# EAGLE design BYOB-BoosterPack-Template (EAGLE 7.3.0)
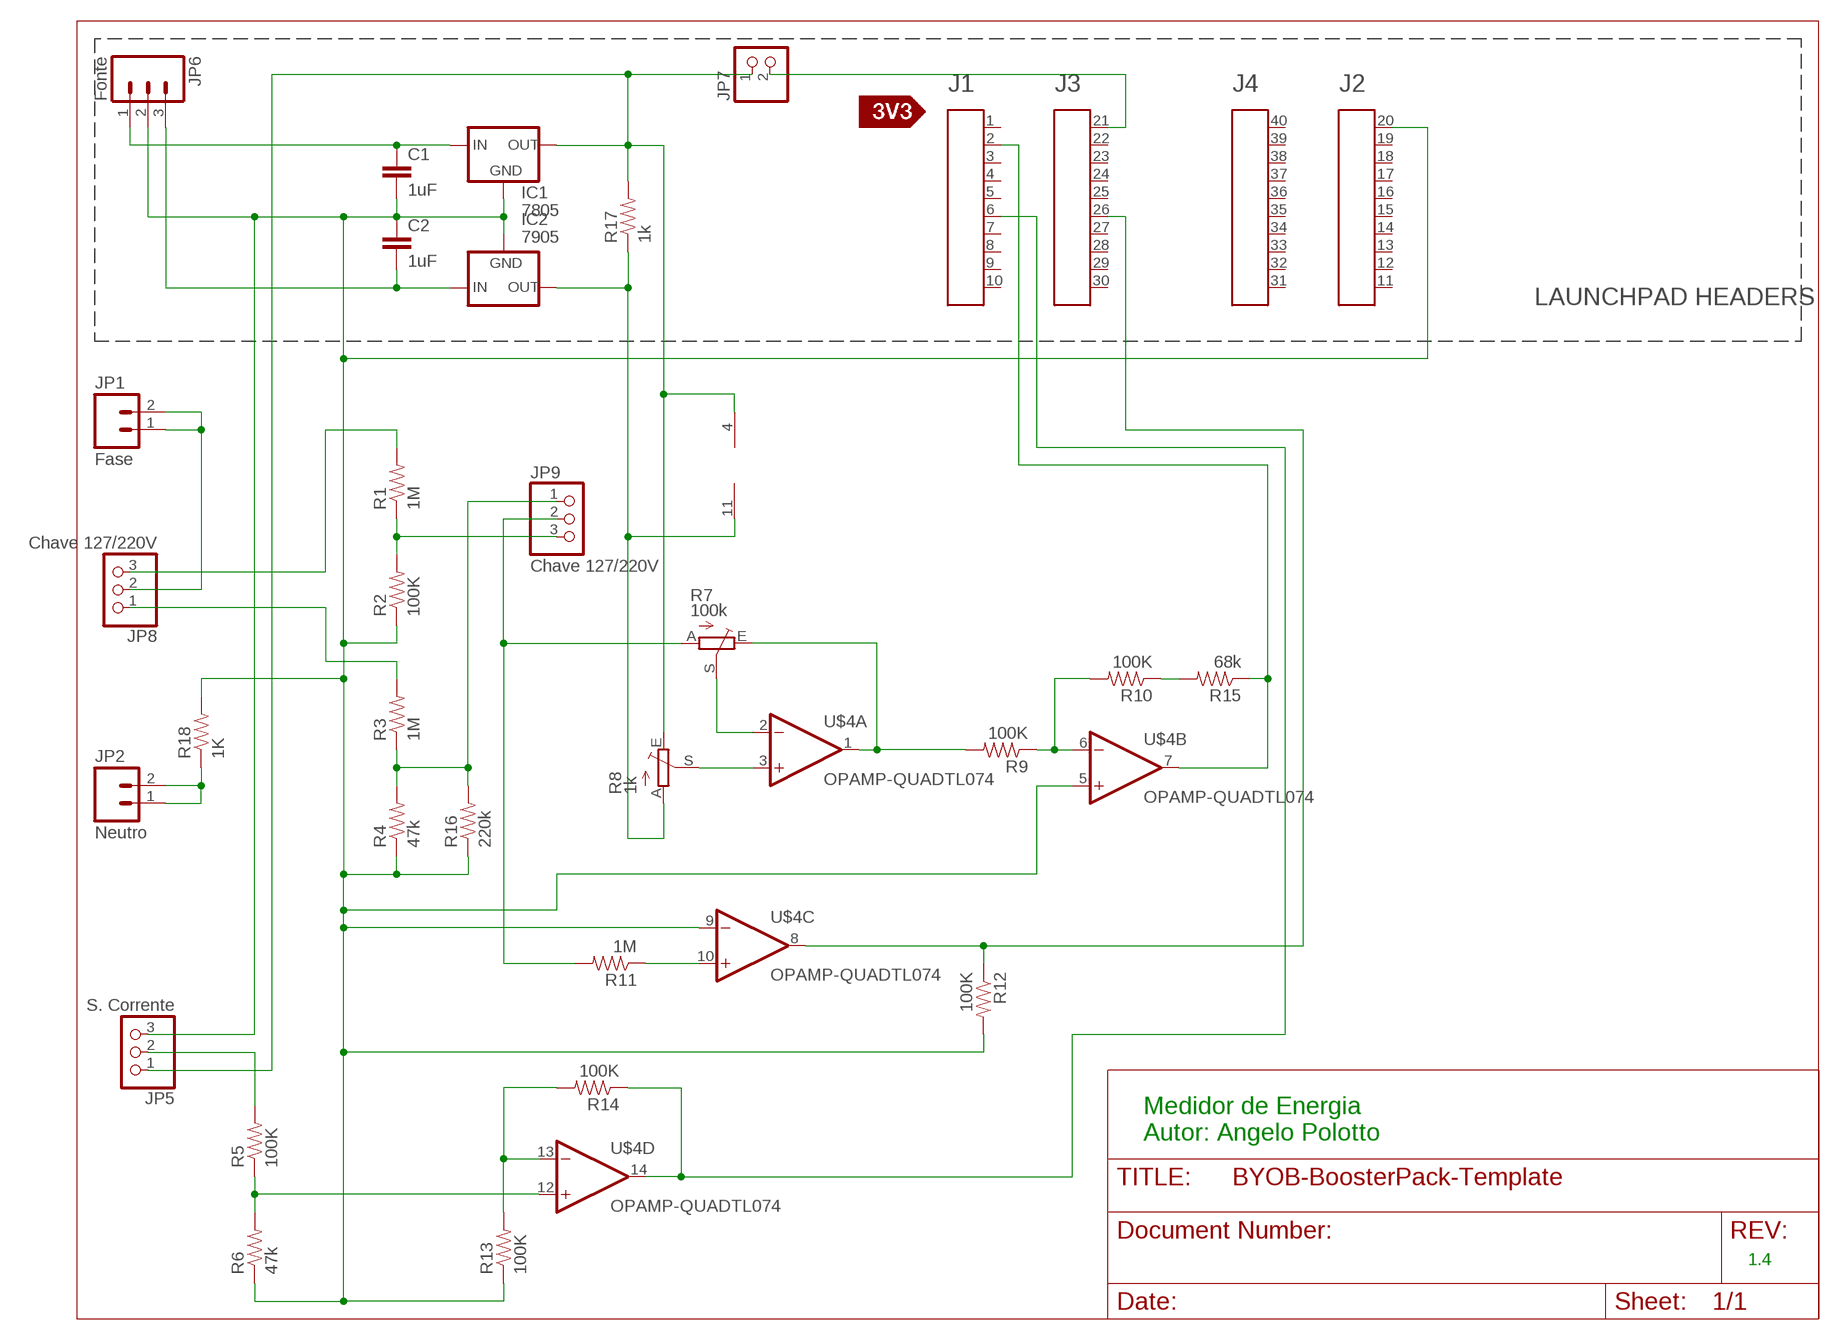
[diagram p0: schematic, sheet 1]

## Parts
A1  HEADER4X10-BOOSTERPACK  [4X10-BOOSTERPACK]
C1  1uF  0.1UF-50V-20%(PTH)KIT-EZ  [CAP-PTH-SMALL-KIT]
C2  1uF  0.1UF-50V-20%(PTH)KIT-EZ  [CAP-PTH-SMALL-KIT]
IC1  7805  78XXS  [78XXS]
IC2  7905  79XXS  [79XXS]
JP1  Fase  M02PTH4  [1X02_XTRA_BIG]
JP2  Neutro  M02PTH4  [1X02_XTRA_BIG]
JP5  S. Corrente  PINHD-1X3  [1X03]
JP6  Fonte  M03-SCREW-5MM  [SCREWTERMINAL-5MM-3]
JP7  PINHD-1X2  [1X02]
JP8  Chave 127/220V  PINHD-1X3  [1X03]
JP9  Chave 127/220V  PINHD-1X3  [1X03]
R1  1M  100KOHM-1/4W-1%(PTH)HORIZ  [AXIAL-0.3]
R2  100K  100KOHM-1/4W-1%(PTH)HORIZ  [AXIAL-0.3]
R3  1M  100KOHM-1/4W-1%(PTH)HORIZ  [AXIAL-0.3]
R4  47k  100KOHM-1/4W-1%(PTH)HORIZ  [AXIAL-0.3]
R5  100K  100KOHM-1/4W-1%(PTH)HORIZ  [AXIAL-0.3]
R6  47k  100KOHM-1/4W-1%(PTH)HORIZ  [AXIAL-0.3]
R7  100k  TRIM_EU-B64Y  [B64Y]
R8  1k  TRIM_EU-B64Y  [B64Y]
R9  100K  100KOHM-1/4W-1%(PTH)HORIZ  [AXIAL-0.3]
R10  100K  100KOHM-1/4W-1%(PTH)HORIZ  [AXIAL-0.3]
R11  1M  100KOHM-1/4W-1%(PTH)HORIZ  [AXIAL-0.3]
R12  100K  100KOHM-1/4W-1%(PTH)HORIZ  [AXIAL-0.3]
R13  100K  100KOHM-1/4W-1%(PTH)HORIZ  [AXIAL-0.3]
R14  100K  100KOHM-1/4W-1%(PTH)HORIZ  [AXIAL-0.3]
R15  68k  100KOHM-1/4W-1%(PTH)HORIZ  [AXIAL-0.3]
R16  220k  100KOHM-1/4W-1%(PTH)HORIZ  [AXIAL-0.3]
R17  1k  100KOHM-1/4W-1%(PTH)HORIZ  [AXIAL-0.3]
R18  1K  100KOHM-1/4W-1%(PTH)HORIZ  [AXIAL-0.3]
U$3  SILK_3V3_TAG  [SILK_3V3_TAG]
U$4  OPAMP-QUADTL074  [DIP14]

## Nets
GND: A1.20 C1.2 C2.1 IC1.GND IC2.GND JP5.3 JP6.2 R2.P$1 R4.P$1 R6.P$1 R12.P$2 R13.P$1 R16.P$1 R18.P$2 U$4.5(B:IN+) U$4.9(C:IN-)
N$1: JP9.3 R1.P$1 R2.P$2
N$2: JP9.1 R3.P$1 R4.P$2 R16.P$2
N$3: R5.P$1 R6.P$2 U$4.12(D:IN+)
N$4: JP8.3 R1.P$2
N$5: JP8.1 R3.P$2
N$6: A1.21 JP7.2
N$7: JP1.1 JP1.2 JP8.2
N$8: JP9.2 R7.A R11.P$2
N$9: JP2.1 JP2.2 R18.P$1
N$10: R7.S U$4.2(A:IN-)
N$11: IC1.OUT JP5.1 JP7.1 R8.E R17.P$2 U$4.4(SUP:VCC)
N$12: R7.E R9.P$2 U$4.1(A:OUT)
N$13: R8.S U$4.3(A:IN+)
N$14: C1.1 IC1.IN JP6.1
N$15: IC2.OUT R8.A R17.P$1 U$4.11(SUP:VEE)
N$16: R9.P$1 R10.P$2 U$4.6(B:IN-)
N$17: R10.P$1 R15.P$2
N$18: R11.P$1 U$4.10(C:IN+)
N$19: A1.26 R12.P$1 U$4.8(C:OUT)
N$20: JP5.2 R5.P$2
N$21: C2.2 IC2.IN JP6.3
N$22: R13.P$2 R14.P$2 U$4.13(D:IN-)
N$23: A1.6 R14.P$1 U$4.14(D:OUT)
N$27: A1.2 R15.P$1 U$4.7(B:OUT)
Unconnected: A1.1 A1.3 A1.4 A1.5 A1.7 A1.8 A1.9 A1.10 A1.11 A1.12 A1.13 A1.14 A1.15 A1.16 A1.17 A1.18 A1.19 A1.22 A1.23 A1.24 A1.25 A1.27 A1.28 A1.29 A1.30 A1.31 A1.32 A1.33 A1.34 A1.35 A1.36 A1.37 A1.38 A1.39 A1.40

## Notes on the sheet
- LAUNCHPAD HEADERS
- Medidor de Energia
  Autor: Angelo Polotto
- 1.4

## Library data of the parts
A1 = Public_BP_Library:HEADER4X10-BOOSTERPACK
C1 C2 = SparkFun-Capacitors:0.1UF-50V-20%(PTH): CAP-08370; PROD_ID: CAP-08370
IC1 = v-reg:78XXS: VOLTAGE REGULATOR
IC2 = v-reg:79XXS: VOLTAGE REGULATOR
JP1 JP2 = SparkFun-Connectors:M02: Standard 2-pin 0.1" header. Use with - straight break away headers ( PRT-00116) - right angle break away headers (PRT-00553) - swiss pins (PRT-00743) - machine pins (PRT-00117) - female headers (PRT-00115) Molex polarized connector foot print use with: PRT-08233 with associated crimp pins and housings. 2.54_SCREWTERM for use with PRT-10571. 3.5mm Screw Terminal footprints for PRT-08084 5mm Screw Terminal footprints for use with PRT-08432
JP5 JP8 JP9 = pinhead:PINHD-1X3: PIN HEADER
JP6 = SparkFun-Connectors:M03: Header 3 Standard 3-pin 0.1" header. Use with straight break away headers (SKU : PRT-00116), right angle break away headers (PRT-00553), swiss pins (PRT-00743), machine pins (PRT-00117), and female headers (PRT-00115). Molex polarized connector foot print use with SKU : PRT-08232 with associated crimp pins and housings.; STOREFRONT_ID: PRT-08433
JP7 = pinhead:PINHD-1X2: PIN HEADER
R1 R3 R4 R6 R11 R15-R18 = SparkFun-Resistors:100KOHM-1/4W-1%(PTH): RES-12184; PROD_ID: RES-12184; VALUE: 100K
R2 R5 R9 R10 R12-R14 = SparkFun-Resistors:100KOHM-1/4W-1%(PTH): RES-12184; PROD_ID: RES-12184
R7 R8 = pot:TRIM_EU-: POTENTIOMETER
U$3 = Public_BP_Library:SILK_3V3_TAG
U$4 = Op Amps:OPAMP-QUAD: Operational amplifier, quad; SPICE: X{NAME}A {A.IN+.NET} {A.IN-.NET} {VCC.NET} {VEE.NET} {A.OUT.NET} TL074\nX{NAME}B {B.IN+.NET} {B.IN-.NET} {VCC.NET} {VEE.NET} {B.OUT.NET} TL074\nX{NAME}C {C.IN+.NET} {C.IN-.NET} {VCC.NET} {VEE.NET} {C.OUT.NET} TL074\nX{NAME}D {D.IN+.NET} {D.IN-.NET} {VCC.NET} {VEE.NET} {D.OUT.NET} TL074; SPICEMOD: .SUBCKT TL074 1 2 3 4 5\nC1 11 12 3.498E-12\nC2 6 7 15.00E-12\nDC 5 53 DX\nDE 54 5 DX\nDLP 90 91 DX\nDLN 92 90 DX\nDP 4 3 DX\nEGND 99 0 POLY(2) (3,0) (4,0) 0 .5 .5\nFB 7 99 POLY(5) VB VC VE VLP VLN 0 4.715E6 -5E6 5E6 5E6 -5E6\nGA 6 0 11 12 282.8E-6\nGCM 0 6 10 99 8.942E-9\nISS 3 10 DC 195.0E-6\nHLIM 90 0 VLIM 1K\nJ1 11 2 10 JX\nJ2 12 1 10 JX\nR2 6 9 100.0E3\nRD1 4 11 3.536E3\nRD2 4 12 3.536E3\nRO1 8 5 150\nRO2 7 99 150\nRP 3 4 2.143E3\nRSS 10 99 1.026E6\nVB 9 0 DC 0\nVC 3 53 DC 2.200\nVE 54 4 DC 2.200\nVLIM 7 8 DC 0\nVLP 91 0 DC 25\nVLN 0 92 DC 25\n.MODEL DX D(IS=800.0E-18)\n.MODEL JX PJF(IS=15.00E-12 BETA=270.1E-6 VTO=-1)\n.ENDS

## Board
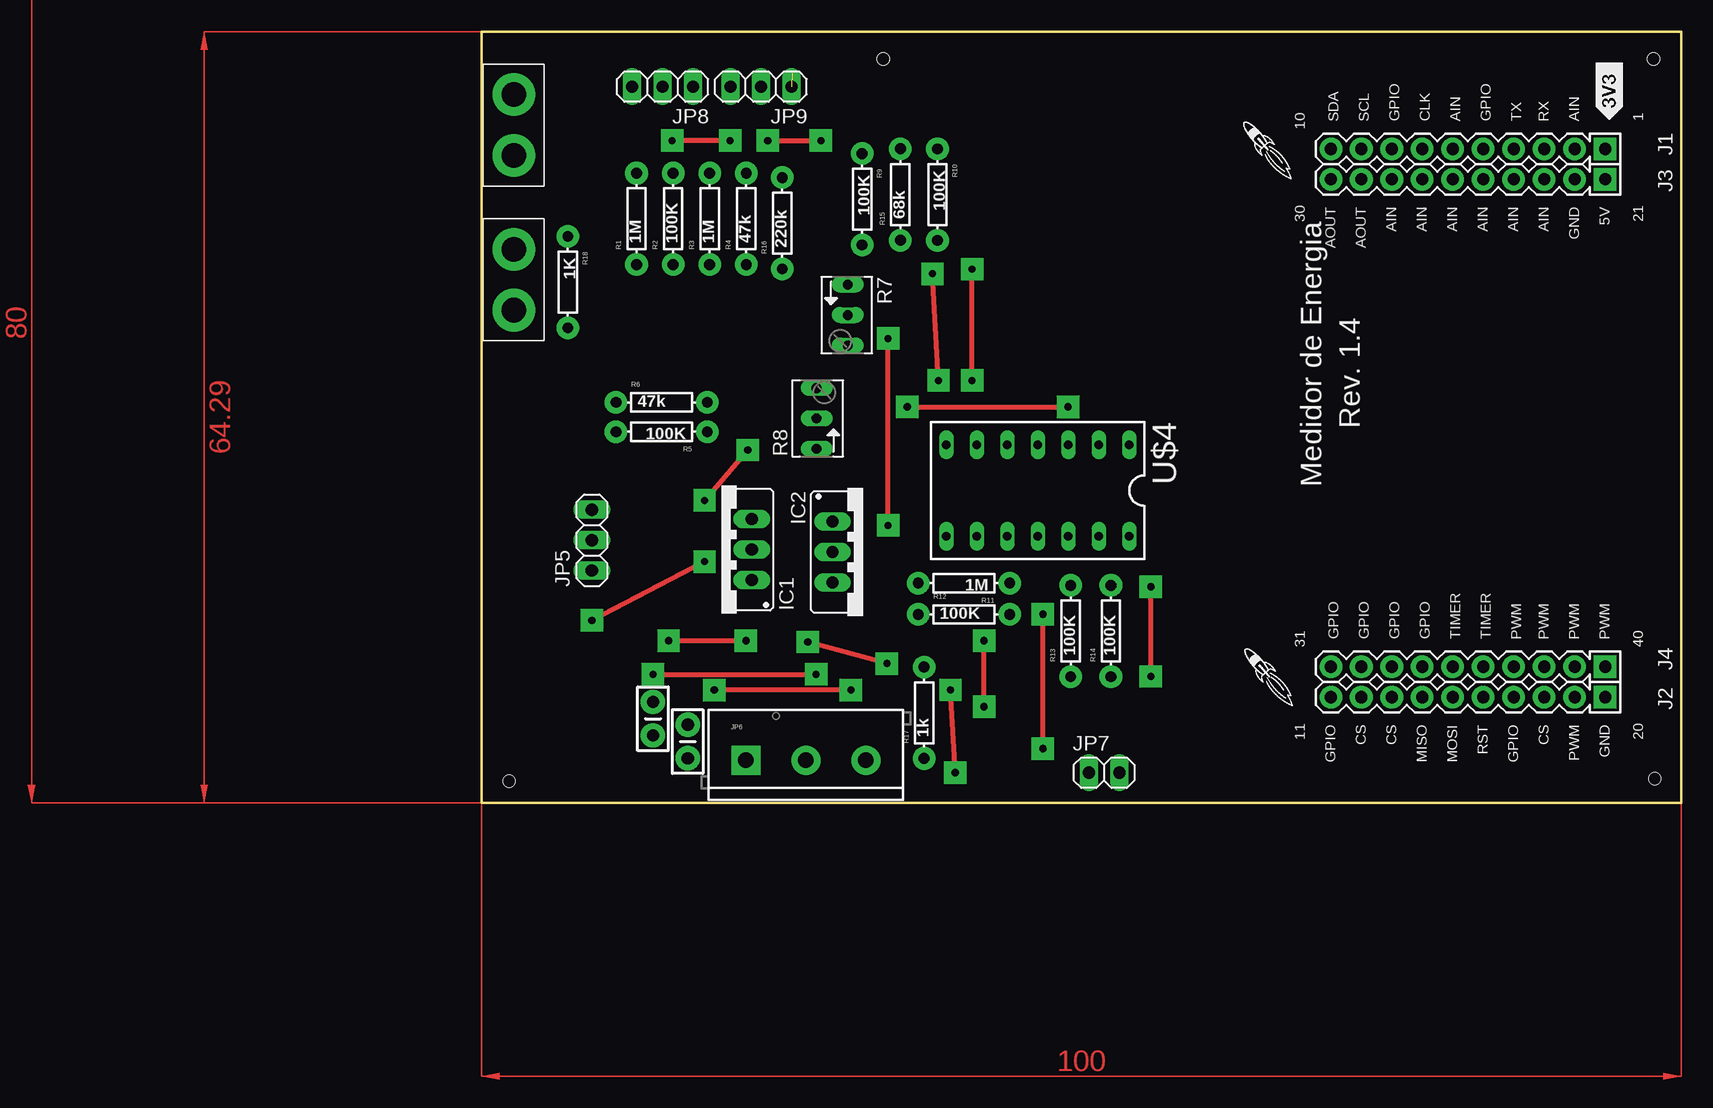
[diagram p1: board, top side]
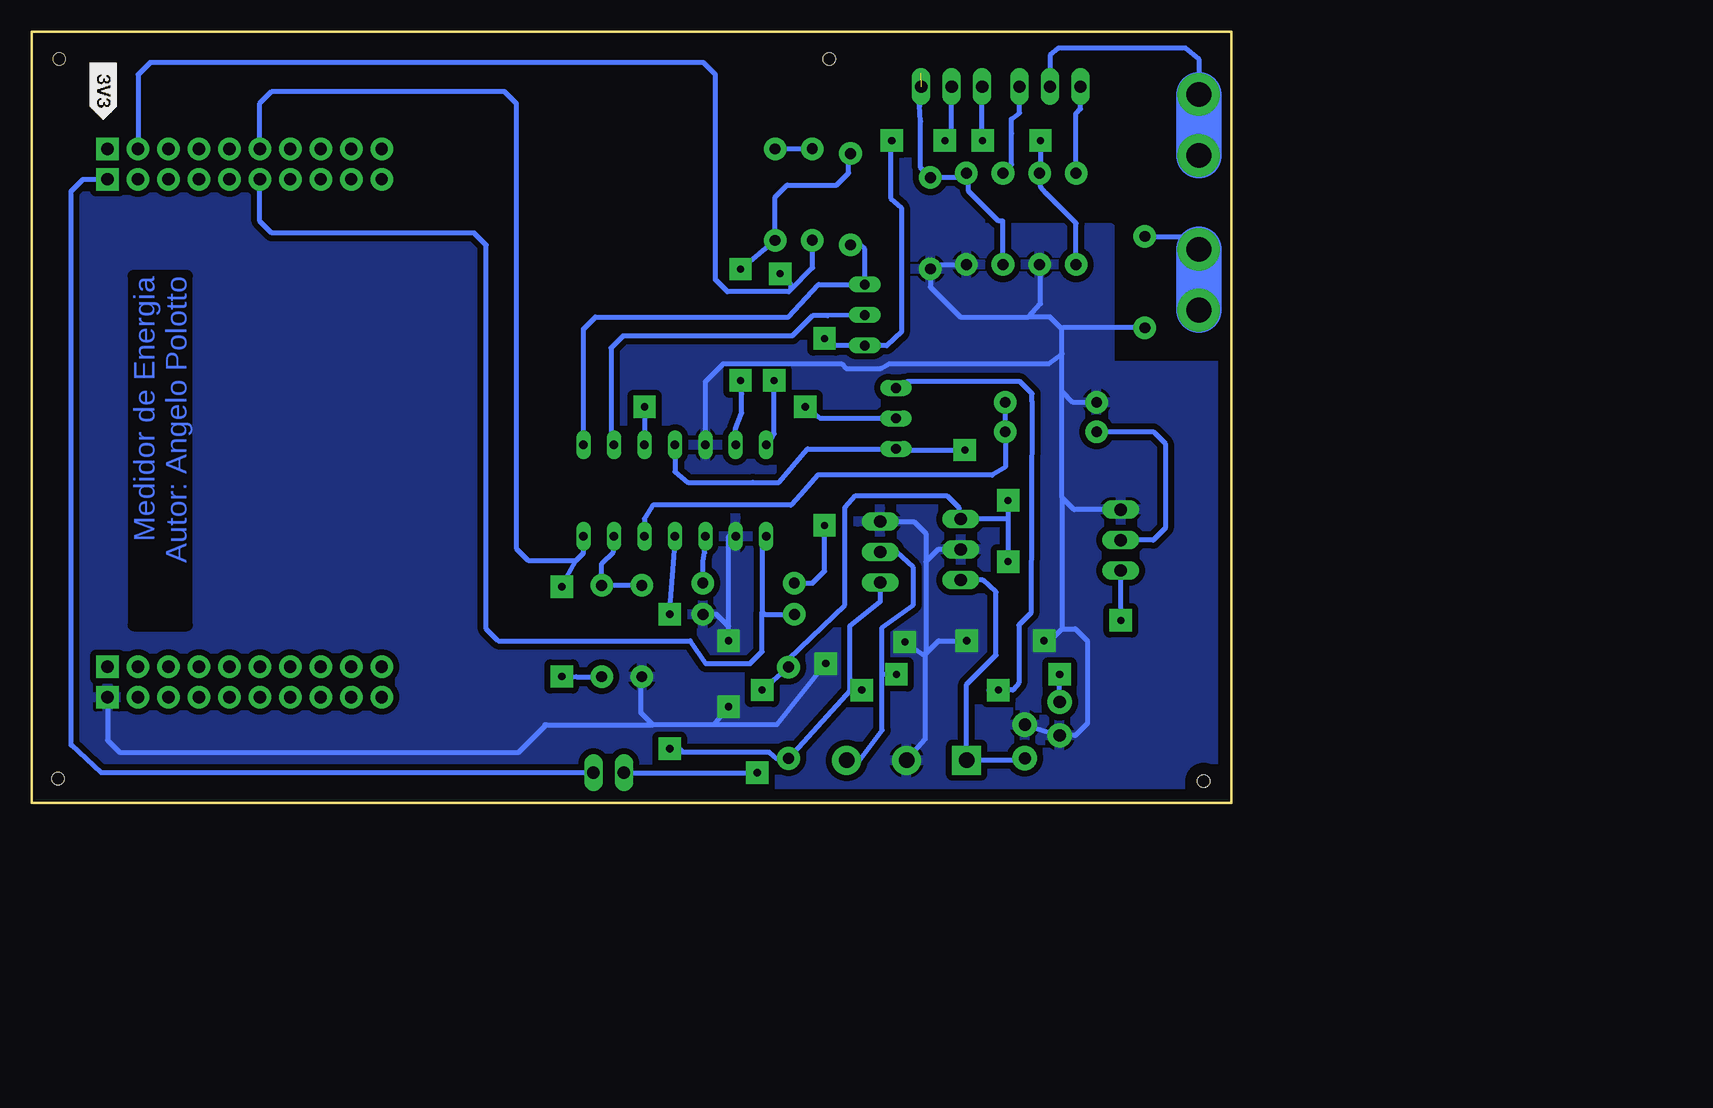
[diagram p2: board, bottom side, seen from below]

Size 100 x 64.29 mm. Coordinates in mm from the lower left corner, seen from the top.
Outline: 0,0 100,0 100,64.29 0,64.29 0,0
Copper layers (1*16): Top 0.035mm / dielectric 1.5mm / Bottom 0.035mm
Design rules "default *": minimum track width 10mil, minimum drill 24mil, track to track 20mil, track to pad 20mil, pad to pad 20mil, via to via 20mil, smd to smd 20mil, copper to edge 40mil, drill to drill 8mil, minimum pad ring 10mil, minimum via ring 25mil, stop-mask expansion 4mil, vias tented up to drill 0mil, thermal gap 10mil
Holes 1 mm at 2.3,1.8 97.8,2 97.7,62 33.5,62

### Footprints (pad centres in the part's own frame; a part is rotated, then mirrored left to right if it is on the bottom)
4X10-BOOSTERPACK = drill 1.016 pad 1.88 square: 1 0,10.16; 20 45.72,10.16; 21 2.54,10.16; 40 43.18,10.16 | drill 1.016 pad 1.88: 2 0,7.62; 3 0,5.08; 4 0,2.54; 5 0,0; 6 0,-2.54; 7 0,-5.08; 8 0,-7.62; 9 0,-10.16; 10 0,-12.7; 11 45.72,-12.7; 12 45.72,-10.16; 13 45.72,-7.62; 14 45.72,-5.08; 15 45.72,-2.54; 16 45.72,0; 17 45.72,2.54; 18 45.72,5.08; 19 45.72,7.62; 22 2.54,7.62; 23 2.54,5.08; 24 2.54,2.54; 25 2.54,0; 26 2.54,-2.54; 27 2.54,-5.08; 28 2.54,-7.62; 29 2.54,-10.16; 30 2.54,-12.7; 31 43.18,-12.7; 32 43.18,-10.16; 33 43.18,-7.62; 34 43.18,-5.08; 35 43.18,-2.54; 36 43.18,0; 37 43.18,2.54; 38 43.18,5.08; 39 43.18,7.62
CAP-PTH-SMALL-KIT = drill 1.016 pad 2.032: 1 -1.397,0; 2 1.397,0
78XXS = drill 1.016 long: GND 0,-2.54; IN -2.54,-2.54; OUT 2.54,-2.54
79XXS = drill 1.016 long: GND -2.54,-2.54; IN 0,-2.54; OUT 2.54,-2.54
1X02_XTRA_BIG = drill 2.057 pad 3.556: 1 -2.54,0; 2 2.54,0
1X03 = drill 1.016 long: 1 -2.54,0; 2 0,0; 3 2.54,0
SCREWTERMINAL-5MM-3 = drill 1.3 pad 2.413 square: 1 0,0 | drill 1.3 pad 2.413: 2 5,0; 3 10,0
1X02 = drill 1.016 long: 1 -1.27,0; 2 1.27,0
AXIAL-0.3 = drill 0.9 pad 1.88: P$1 -3.81,0; P$2 3.81,0
B64Y = drill 0.813 long: A 2.54,0; E -2.54,0; S 0,0
DIP14 = drill 0.7 long: 1 0,7.62; 2 0,5.08; 3 0,2.54; 4 0,0; 5 0,-2.54; 6 0,-5.08; 7 0,-7.62; 8 7.62,-7.62; 9 7.62,-5.08; 10 7.62,-2.54; 11 7.62,0; 12 7.62,2.54; 13 7.62,5.08; 14 7.62,7.62

### Placement (x,y rotation side)
A1  83.51,54.51 270 top
C1  17.2,5.1 90 top
C2  14.3,7 90 top
IC1  20,21.1 90 top
IC2  31.8,20.9 270 top
JP1  2.7,56.5 90 top
JP2  2.7,43.6 90 top
JP5  9.21,21.89 90 top
JP6  22.05,3.54 0 top
JP7  51.9,2.5 0 top
JP8  15.1,59.7 180 top
JP9  23.3,59.7 180 top
R1  12.93,48.67 90 top
R2  15.98,48.67 90 top
R3  19.03,48.67 90 top
R4  22.08,48.67 90 top
R5  15.03,30.92 180 top
R6  15.03,33.37 0 top
R7  30.54,40.66 270 top
R8  27.94,32.04 90 top
R9  31.73,50.31 270 top
R10  38.02,50.69 270 top
R11  40.23,18.31 180 top
R12  40.22,15.69 0 top
R13  49.13,14.31 90 top
R14  52.47,14.31 90 top
R15  34.92,50.71 90 top
R16  25.07,48.31 90 top
R17  36.9,7.5 90 top
R18  7.2,43.4 270 top
U$1  [LOGO-ROCKET]  65.45,10.61 90 top
U$2  [LOGO-ROCKET]  65.35,54.53 90 top
U$3  95.15,61.71 270 bottom
U$4  46.38,29.83 270 top

### Tracks (layer width: path | path; a pad name or v marks a point on that pad's centre or on a via)
GND  (via drill 0.6)
  Top 0.406: v41.9,8 v41.9,13.5 | v33.8,11.6 v27.2,13.4 | v22.05,13.5 v15.6,13.5
  Bottom 0.406: U$4.9 41.9,22.21 v41.9,13.5 41.9,14.69 42.9,15.69 R12.P$2 | 16.9,40.5 15.1,40.5 14.1,39.5 | 16.9,40.5 15.9,41.6 15.9,44.86 R2.P$1 | 16.9,40.5 22.57,40.5 25.07,43 R16.P$1 25.07,44.86 R4.P$1 | v33.8,11.6 37.9,6.5 43.1,6.5 | 43.1,6.5 v41.9,8 | 43.1,6.5 48.2,6.5 | 48.2,6.5 49.2,7.5 49.2,10.5 R13.P$1 | JP6.2 25.5,5.3 25.5,12.2 | 25.5,12.2 25.5,12.45 25.45,12.5 | 25.45,12.5 25.4,12.5 24.4,13.5 v22.05,13.5 | IC1.GND 24.45,21.1 25.45,20.1 | 25.45,20.1 25.45,12.5 | IC2.GND 26.45,23.44 25.45,22.44 25.45,20.1 | v27.2,13.4 25.5,12.2 | 14.1,25.43 14.1,34.3 | 14.1,34.3 14.1,37.4 | 14.1,37.4 14.1,39.5 | JP5.3 13.1,24.43 14.1,25.43 | 14.1,25.43 14.1,14.5 | 14.1,14.5 15.1,13.5 v15.6,13.5 | R6.P$1 13.17,33.37 14.1,34.3 | U$4.5 43.84,35.1 42.34,36.6 32.5,36.6 32.1,36.2 29.2,36.2 28.5,36.6 15.2,36.6 14.1,37.4 | A1.20 93.67,5.2 92.67,4.2 59.4,4.2 57.1,6.5 | 57.2,6.5 57.1,6.5 | 57.1,6.5 48.2,6.5 | R18.P$2 14.01,39.59 14.1,39.5 | C1.2 C2.1 13,5.6 12,6.6 12,13.5 13,14.5 14.1,14.5
  pour Bottom: 99.9,0 0.3,0 0.3,36.4 10.1,36.4 10.1,47.9 20.9,47.9 20.9,64 29.5,64 99.9,64.2
N$1  (via drill 0.6)
  Top 0.406: v20.73,55.2 v15.9,55.2
  Bottom 0.406: v15.9,55.2 15.9,52.48 | R1.P$1 12.93,48.3 15.43,50.8 15.9,51.34 15.9,52.48 | 15.9,52.48 R2.P$2 | v20.73,55.2 20.76,55.23 JP9.3
N$2  (1 unrouted)
  Bottom 0.406: R3.P$1 19.03,48.5 19.4,48.5 21.9,51 21.9,52.48 R4.P$2 22.08,52.12 R16.P$2 25.9,52.95 25.9,56.8 25.97,58.1 25.9,58.5 25.9,60.84
N$3
  Bottom 0.406: U$4.12 48.92,23.68 48.2,24.8 36.7,24.8 35.9,25.7 34.5,27.3 19.94,27.3 18.84,28 R5.P$1 R6.P$2
N$4
  Bottom 0.406: R1.P$2 12.93,57.5 12.9,57.5 12.56,57.84 JP8.3
N$5
  Bottom 0.406: R3.P$2 18.3,53.21 18.3,55.8 18.33,57 17.64,57.49 JP8.1
N$6
  Bottom 0.406: JP7.2 94.2,2.5 96.7,4.8 96.7,50.97 95.7,51.97 A1.21
N$7
  Bottom 0.406: JP8.2 15.1,62.3 14.4,62.9 3.8,62.9 2.7,62 JP1.2
  Bottom 3.81: JP1.2 JP1.1
N$8  (via drill 0.6)
  Top 0.406: v33.9,23.12 v33.9,38.7 | v23.87,55.2 v28.3,55.2
  Bottom 0.406: R11.P$2 34.9,18.31 33.9,19.31 v33.9,23.12 | v28.3,55.2 28.4,55.2 28.4,50.4 27.5,49.6 27.5,39.22 28.7,38.12 28.7,38.1 R7.A 33.32,38.12 v33.9,38.7 | v23.87,55.2 23.3,55.13 JP9.2
N$9
  Bottom 0.406: R18.P$1 3.77,47.21 JP2.2
  Bottom 3.81: JP2.2 JP2.1
N$10
  Bottom 0.406: R7.S 33.64,40.6 34.9,40.6 36.6,38.9 50.7,38.9 51.7,37.9 51.7,29.93 U$4.2
N$11  (via drill 0.6)
  Top 0.406: v39.5,2.5 v39.1,9.4 | v18.6,20.1 v9.2,15.2 | v22.2,29.4 v18.6,25.2
  Bottom 0.406: JP7.1 v39.5,2.5 | v39.1,9.4 R17.P$2 36.9,12 32.2,16.5 32.2,24.6 31.3,25.6 23.7,25.6 22.7,24.6 22.7,23.64 IC1.OUT | IC1.OUT 22.54,23.6 | v18.6,25.2 18.6,23.7 | 18.6,23.7 v18.6,20.1 | v9.2,15.2 JP5.1 | v22.2,29.4 27.94,29.4 R8.E 35.3,29.5 37.7,26.7 39.9,26.7 45.28,26.7 46.38,27.6 U$4.4 | IC1.OUT 22.54,23.7 18.6,23.7
N$12
  Bottom 0.406: U$4.1 54,39.5 53,40.5 36.9,40.5 34.4,43.2 R7.E 30.54,46.14 30.9,46.5 R9.P$2
N$13  (via drill 0.6)
  Top 0.406: v35.5,33 v48.9,33
  Bottom 0.406: v48.9,33 48.9,29.83 U$4.3 | R8.S 34.24,32.04 v35.5,33
N$14
  Bottom 0.406: IC1.IN 20.7,18.56 19.6,17.56 19.6,12.3 22.05,9.85 JP6.1 17.36,3.54 C1.1
N$15  (via drill 0.6)
  Top 0.406: v46.8,4.5 v46.8,15.71 | v30.8,9.39 v19.41,9.39
  Bottom 0.406: v46.8,4.5 46,4.5 45.7,4.2 38.5,4.2 37.89,3.69 R17.P$1 32.1,9 31.8,9.3 31.3,9.3 31.21,9.39 v30.8,9.39 31.39,9.39 31.8,9.4 31.8,14.7 29.26,16.74 IC2.OUT | v46.8,15.71 46.3,22.13 U$4.11 | 19.6,9.39 v19.41,9.39 | v19.41,9.39 20.2,9.39 | v19.41,9.39 18.2,9.39 17.7,9.99 17.7,14.8 16.7,15.8 16.6,33.4 16.6,34.1 17.6,35.1 27.02,35.1 R8.A
N$16  (via drill 0.6)
  Top 0.406: v40.9,35.2 v40.9,44.48
  Bottom 0.406: R9.P$1 31.9,54.12 31.9,52.5 32.9,51.5 37.02,51.5 38.02,50.5 R10.P$2 v40.9,44.48 | U$4.6 41.3,31.2 40.8,32.5 40.8,34.1 v40.9,35.2
N$17
  Bottom 0.406: R10.P$1 R15.P$2
N$18
  Bottom 0.406: R11.P$1 44.04,20.1 43.9,20.84 43.9,22.21 U$4.10
N$19
  Bottom 0.406: U$4.8 38.9,22.21 39.1,22.01 39.1,15.9 | 39.1,15.9 38.9,15.69 R12.P$1 | 39.1,15.9 39.1,12.6 40.1,11.6 43.8,11.6 45.1,13.5 61.1,13.5 62.1,14.5 62.1,46.5 63.1,47.5 79.97,47.5 80.97,48.5 A1.26
N$20
  Bottom 0.406: R5.P$2 6.5,30.92 5.5,29.92 5.5,22.89 6.5,21.89 JP5.2
N$21  (via drill 0.6)
  Top 0.406: v14.3,10.7 v27.9,10.7
  Bottom 0.406: JP6.3 31,3.54 29.1,6.04 29.1,10.7 | IC2.IN 27.9,20.9 26.5,19.6 26.5,16.5 29.1,14.6 29.1,10.7 | C2.2 v14.3,10.7 | v27.9,10.7 29.1,10.7
N$22
  Bottom 0.406: R13.P$2 R14.P$2 52.47,19.93 51.5,20.9 51.5,22.17 U$4.13
N$23  (via drill 0.6)
  Top 0.406: v55.8,10.53 v55.8,18.01
  Bottom 0.406: v55.8,18.01 54.6,20.2 | 54.6,20.2 54,20.8 U$4.14 | v55.8,10.53 54.57,10.5 R14.P$1 | A1.6 80.97,58.3 79.97,59.3 60.6,59.3 59.6,58.3 59.6,21.2 58.6,20.2 54.6,20.2
N$27  (via drill 0.6)
  Top 0.406: v38.1,35.2 v37.6,44.1
  Bottom 0.406: 38.76,29.5 U$4.7 38.9,29.83 38.9,29.5 38.76,29.5 | R15.P$1 34.9,46.5 34.9,44.6 36.75,42.75 | A1.2 91.13,60.7 90.13,61.7 44,61.7 43,60.7 43,43.6 42,42.6 36.9,42.6 36.75,42.75 | 38.76,29.5 38.1,30.76 v38.1,35.2 | v37.6,44.1 36.75,43.25 36.75,42.75
(copper drawn outside any net)
  shapes: Top area x3

### Text on the board
Bottom: Medidor de Energia / Autor: Angelo Polotto
tPlace: Medidor de Energia | Rev. 1.4